# Altium schematic sheet IO_FMU_REV_2A.SchDoc: Cube Yellow and Cube Orange
size A3; Date: 18/08/2014 1:53:23 PM; Author: PR; DrawnBy: Philip Rowse; Engineer: Philip Rowse; Organization: ProfiCNC/Hex; Address3: VIC; Address4: Australia; Revision: A; SheetNumber: 4; SheetTotal: 10
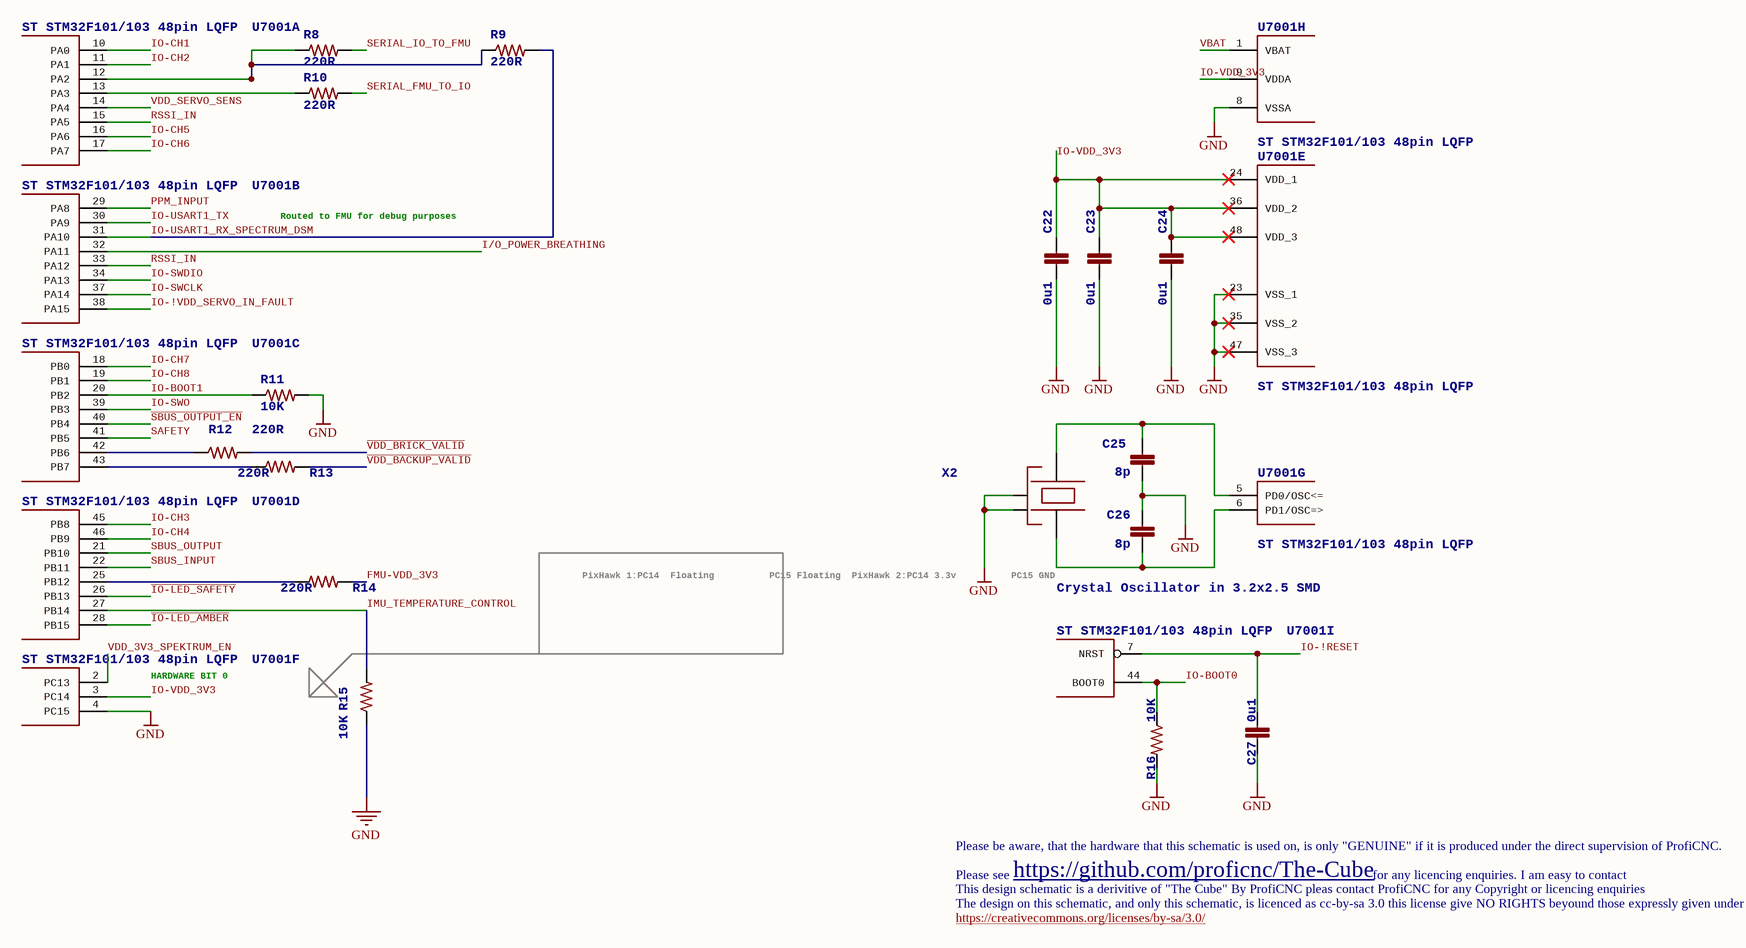
[diagram p0: IO_FMU_REV_2A.SchDoc]

## Parts
C22  0u1  [0402-CAP]
C23  0u1  [0402-CAP]
C24  0u1  [0402-CAP]
C25  8p  [0402-CAP]
C26  8p  [0402-CAP]
C27  0u1  [0402-CAP]
R8  220R  [0402-RES]
R9  220R  [0402-RES]
R10  220R  [0402-RES]
R11  10K  [0402-RES]
R12  220R  [0402-RES]
R13  220R  [0402-RES]
R14  220R  [0402-RES]
R15  10K  [0402-RES]
R16  10K  [0402-RES]
U7001  ST STM32F101/103 48pin LQFP  [TQFP48]  (parts A,B,C,D,E,F,G,H,I of 9)
X2  Crystal Oscillator in 3.2x2.5 SMD  [OSCILLATOR-3.2X2.5]

## Nets
GND: C22.P$2 C23.P$2 C24.P$2 C25.P$2 C26.P$1 C27.P$1 R11.P$2 R15.P$1 R16.P$2 U7001.4(PC15) U7001.8(VSSA) U7001.23(VSS_1) U7001.35(VSS_2) U7001.47(VSS_3) X2.2(NC_2) X2.4(NC_4)
FMU-VDD_3V3: R14.P$2
I/O_POWER_BREATHING: U7001.32(PA11)
~{IO-LED_AMBER}: U7001.28(PB15)
~{IO-LED_SAFETY}: U7001.26(PB13)
IMU_TEMPERATURE_CONTROL: R15.P$2 U7001.27(PB14)
IO-!RESET: C27.P$2 U7001.7(NRST)
IO-!VDD_SERVO_IN_FAULT: U7001.38(PA15)
IO-BOOT0: R16.P$1 U7001.44(BOOT0)
IO-BOOT1: R11.P$1 U7001.20(PB2)
IO-CH1: U7001.10(PA0)
IO-CH2: U7001.11(PA1)
IO-CH3: U7001.45(PB8)
IO-CH4: U7001.46(PB9)
IO-CH5: U7001.16(PA6)
IO-CH6: U7001.17(PA7)
IO-CH7: U7001.18(PB0)
IO-CH8: U7001.19(PB1)
IO-SWCLK: U7001.37(PA14)
IO-SWDIO: U7001.34(PA13)
IO-SWO: U7001.39(PB3)
IO-USART1_RX_SPECTRUM_DSM: R9.P$2 U7001.31(PA10)
IO-USART1_TX: U7001.30(PA9)
IO-VDD_3V3: C22.P$1 C23.P$1 C24.P$1 U7001.3(PC14) U7001.9(VDDA) U7001.24(VDD_1) U7001.36(VDD_2) U7001.48(VDD_3)
PPM_INPUT: U7001.29(PA8)
RSSI_IN: U7001.15(PA5) U7001.33(PA12)
~{SBUS_OUTPUT_EN}: U7001.40(PB4)
SAFETY: U7001.41(PB5)
SBUS_INPUT: U7001.22(PB11)
SBUS_OUTPUT: U7001.21(PB10)
SERIAL_FMU_TO_IO: R10.P$2
SERIAL_IO_TO_FMU: R8.P$2
~{VDD_BACKUP_VALID}: R13.P$2
~{VDD_BRICK_VALID}: R12.P$2
VBAT: U7001.1(VBAT)
VDD_3V3_SPEKTRUM_EN: U7001.2(PC13)
VDD_SERVO_SENS: U7001.14(PA4)
NetC25_P$1: C25.P$1 U7001.5(PD0/OSC<=) X2.3
NetC26_P$2: C26.P$2 U7001.6(PD1/OSC=>) X2.1
NetR8_P$1: R8.P$1 R9.P$1 U7001.12(PA2)
NetR10_P$1: R10.P$1 U7001.13(PA3)
NetR12_P$1: R12.P$1 U7001.42(PB6)
NetR13_P$1: R13.P$1 U7001.43(PB7)
NetR14_P$1: R14.P$1 U7001.25(PB12)

## Notes on the sheet
- Routed to FMU for debug purposes
- PixHawk 1:PC14  Floating
  PC15 Floating
  PixHawk 2:PC14 3.3v
  PC15 GND
- HARDWARE BIT 0
- Please be aware, that the hardware that this schematic is used on, is only "GENUINE" if it is produced under the direct supervision of ProfiCNC.
- The design on this schematic, and only this schematic, is licenced as cc-by-sa 3.0 this license give NO RIGHTS beyound those expressly given under the terms of this license.
- This design schematic is a derivitive of "The Cube" By ProfiCNC pleas contact ProfiCNC for any Copyright or licencing enquiries
- https://creativecommons.org/licenses/by-sa/3.0/
- Please see
- https://github.com/proficnc/The-Cube
- for any licencing enquiries. I am easy to contact
- Drawn By:
- Verified for production by:
- Approved for release:
- Title
- Size:
- Date:
- A
- Number:
- Time:
- Revision:
- Sheet
- of
- File:

## Library data of the parts
C22-C24 C27 = CAP0402: CAP CER 0.1UF 16V Y5V 0402; Value: 0u1
C25 C26 = CAP0402: CAP CER 8PF 50V C0G 0402; Value: 8p
R8-R10 R12-R14 = RESISTOR0402-RES: RES 220 OHM 1/16W 1% 0402 SMD; Value: 220R
R11 R15 R16 = RESISTOR0402-RES: RES 10K OHM 1/16W 1% 0402 SMD; Value: 10K
U7001 = STM32F10XCXT6: MCU 32BIT ARM 64K FLASH 48LQFP
X2 = OSCILLATOR-3.2X2.5: CRYSTAL 24MHZ 8PF SMD; Value: 24MHz